# Altium schematic sheet POC-9axe.SchDoc
size A4
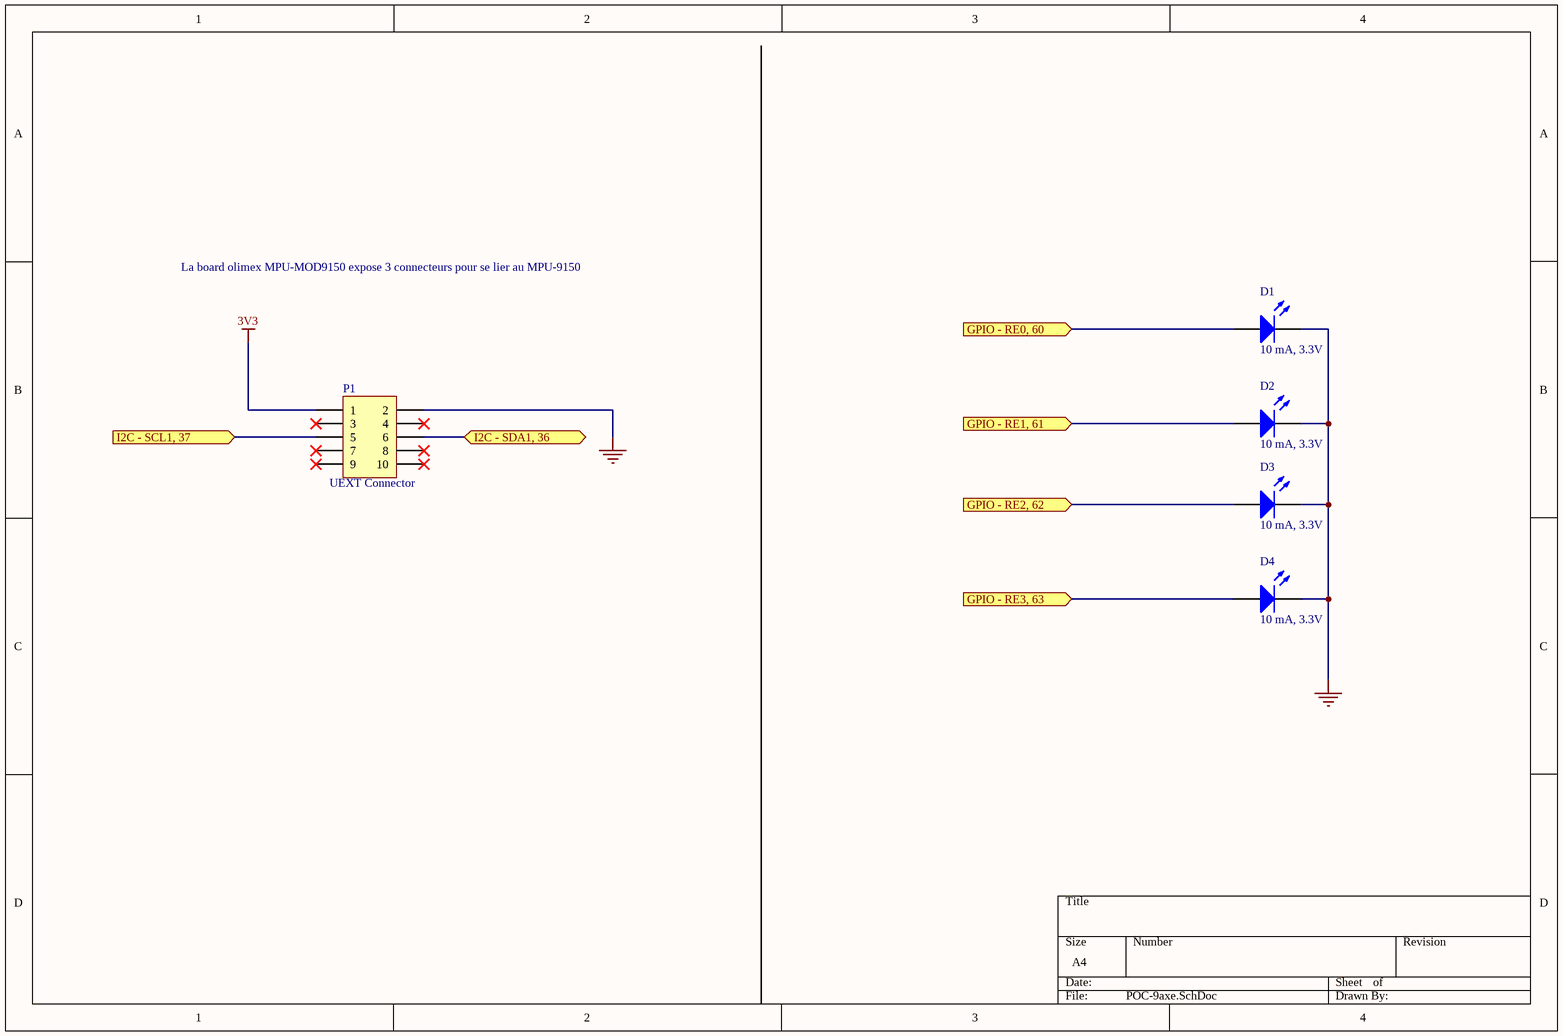
[diagram p0: POC-9axe.SchDoc]

## Parts
D1  10 mA, 3.3V  [3.5X2.8X1.9]
D2  10 mA, 3.3V  [3.5X2.8X1.9]
D3  10 mA, 3.3V  [3.5X2.8X1.9]
D4  10 mA, 3.3V  [3.5X2.8X1.9]
P1  UEXT Connector  [MHDR2X5]

## Ports
GPIO - RE0, 60 (in), GPIO - RE1, 61 (in), GPIO - RE2, 62 (in), GPIO - RE3, 63 (in), I2C - SCL1, 37 (in), I2C - SDA1, 36 (bidir)

## Nets
3V3: P1.1
GND: D1.2(K) D2.2(K) D3.2(K) D4.2(K) P1.2
GPIO - RE0, 60: D1.1(A) ; port GPIO - RE0, 60
GPIO - RE1, 61: D2.1(A) ; port GPIO - RE1, 61
GPIO - RE2, 62: D3.1(A) ; port GPIO - RE2, 62
GPIO - RE3, 63: D4.1(A) ; port GPIO - RE3, 63
I2C - SCL1, 37: P1.5 ; port I2C - SCL1, 37
I2C - SDA1, 36: P1.6 ; port I2C - SDA1, 36

Not connected (* = marked no-connect by the designer): P1 3* 4* 7* 8* 9* 10*

## Notes on the sheet
- La board olimex MPU-MOD9150 expose 3 connecteurs pour se lier au MPU-9150

## Library data of the parts
D1-D4 = LED3: Typical BLUE SiC LED; Amperage: 10 mA; Fournisseur: Farnell; RefFournisseur: 1200588; Fabricant: FORGE; RefFabricant: FNL-U500B23CDSL; Published: 8-Jun-2000; LatestRevisionDate: 17-Dec-2003; LatestRevisionNote: PCB Footprint replaced.; DatasheetVersion: 16-Apr-2002; PackageVersion: 16-Apr-2002; PackageReference: 3.5X2.8X1.9; Publisher: Altium Limited; PackageDescription: SM LED; 2 C-Bend Leads; Body 3.5 x 2.8 x 1.9 mm, inc leads (LxWxH typ); Voltage: 3.3V
P1 = MHDR2X5: Header, 5-Pin, Dual row; LatestRevisionDate: 17-Jul-2002; LatestRevisionNote: Re-released for DXP Platform.; Publisher: Altium Limited